# Altium schematic sheet input1-9.SchDoc
size 594 x 420 mm; Обозначение документа: QFP input1-9; Номер листа: 4; Общее количество листов: 9
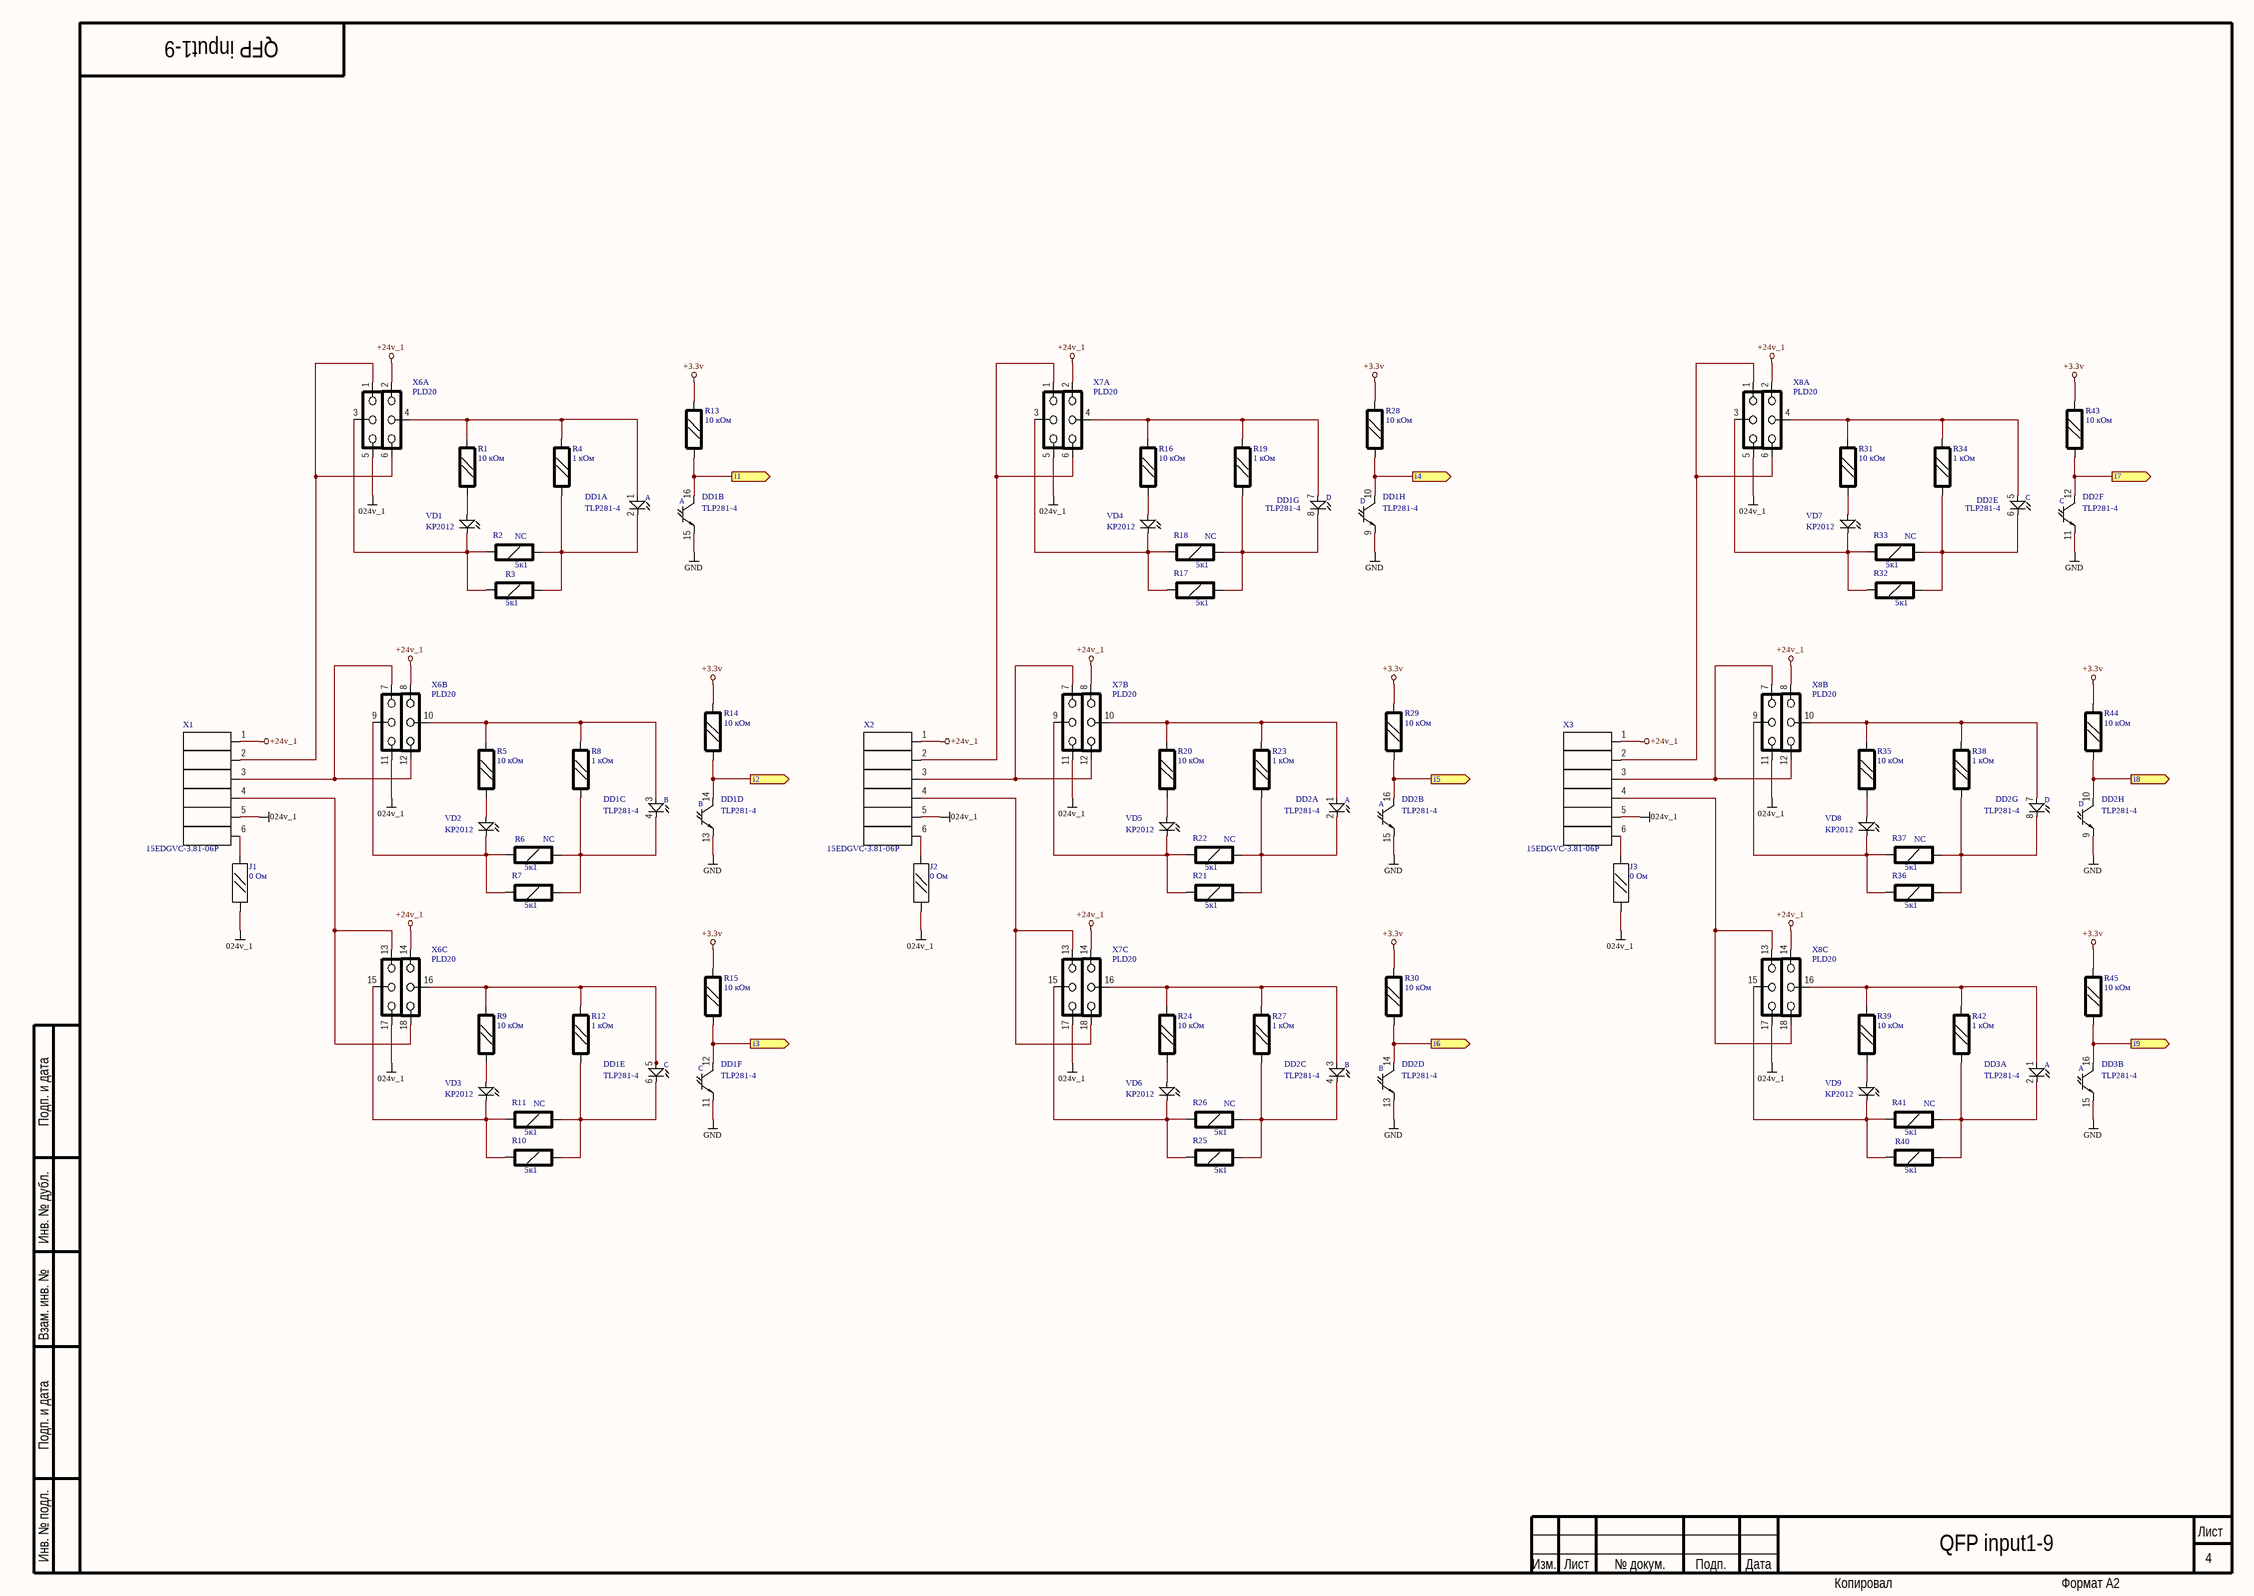
[diagram p0: input1-9.SchDoc]

## Parts
DD1  TLP281-4  [SO16]  (parts A,B,C,D,E,F,G,H of 8)
DD2  TLP281-4  [SO16]  (parts A,B,C,D,E,F,G,H of 8)
DD3  TLP281-4  [SO16]  (parts A,B of 8)
J1  0 Ом  [SMD0805RES]
J2  0 Ом  [SMD0805RES]
J3  0 Ом  [SMD0805RES]
R1  10 кОм  [SMD0805RES]
R2  5к1  SolderOpton: NC  [RES1206]
R3  5к1  [RES1206]
R4  1 кОм  [SMD0805RES]
R5  10 кОм  [SMD0805RES]
R6  5к1  SolderOpton: NC  [RES1206]
R7  5к1  [RES1206]
R8  1 кОм  [SMD0805RES]
R9  10 кОм  [SMD0805RES]
R10  5к1  [RES1206]
R11  5к1  SolderOpton: NC  [RES1206]
R12  1 кОм  [SMD0805RES]
R13  10 кОм  [SMD0805RES]
R14  10 кОм  [SMD0805RES]
R15  10 кОм  [SMD0805RES]
R16  10 кОм  [SMD0805RES]
R17  5к1  [RES1206]
R18  5к1  SolderOpton: NC  [RES1206]
R19  1 кОм  [SMD0805RES]
R20  10 кОм  [SMD0805RES]
R21  5к1  [RES1206]
R22  5к1  SolderOpton: NC  [RES1206]
R23  1 кОм  [SMD0805RES]
R24  10 кОм  [SMD0805RES]
R25  5к1  [RES1206]
R26  5к1  SolderOpton: NC  [RES1206]
R27  1 кОм  [SMD0805RES]
R28  10 кОм  [SMD0805RES]
R29  10 кОм  [SMD0805RES]
R30  10 кОм  [SMD0805RES]
R31  10 кОм  [SMD0805RES]
R32  5к1  [RES1206]
R33  5к1  SolderOpton: NC  [RES1206]
R34  1 кОм  [SMD0805RES]
R35  10 кОм  [SMD0805RES]
R36  5к1  [RES1206]
R37  5к1  SolderOpton: NC  [RES1206]
R38  1 кОм  [SMD0805RES]
R39  10 кОм  [SMD0805RES]
R40  5к1  [RES1206]
R41  5к1  SolderOpton: NC  [RES1206]
R42  1 кОм  [SMD0805RES]
R43  10 кОм  [SMD0805RES]
R44  10 кОм  [SMD0805RES]
R45  10 кОм  [SMD0805RES]
VD1  KP2012  [SMD0805DIO_C]
VD2  KP2012  [SMD0805DIO_C]
VD3  KP2012  [SMD0805DIO_C]
VD4  KP2012  [SMD0805DIO_C]
VD5  KP2012  [SMD0805DIO_C]
VD6  KP2012  [SMD0805DIO_C]
VD7  KP2012  [SMD0805DIO_C]
VD8  KP2012  [SMD0805DIO_C]
VD9  KP2012  [SMD0805DIO_C]
X1  15EDGVC-3.81-06P  [15EDGVC_081_6]
X2  15EDGVC-3.81-06P  [15EDGVC_081_6]
X3  15EDGVC-3.81-06P  [15EDGVC_081_6]
X6  PLD20  [pld2x10_1.27]  (parts A,B,C of 7)
X7  PLD20  [pld2x10_1.27]  (parts A,B,C of 7)
X8  PLD20  [pld2x10_1.27]  (parts A,B,C of 7)

## Ports
i1 (out), i2 (out), i3 (out), i4 (out), i5 (out), i6 (out), i7 (out), i8 (out), i9 (out)

## Nets
024v_1: J1.1 J2.2 J3.2 X1.5 X2.5 X3.5 X6.5 X6.11 X6.17 X7.5 X7.11 X7.17 X8.5 X8.11 X8.17
+3.3v: R13.2 R14.2 R15.2 R28.2 R29.2 R30.2 R43.2 R44.2 R45.2
+24v_1: X1.1 X2.1 X3.1 X6.2 X6.8 X6.14 X7.2 X7.8 X7.14 X8.2 X8.8 X8.14
GND: DD1.9(Emitter_D) DD1.11(Emitter_C) DD1.13(Emitter_B) DD1.15(Emitter_A) DD2.9(Emitter_D) DD2.11(Emitter_C) DD2.13(Emitter_B) DD2.15(Emitter_A) DD3.15(Emitter_A)
i1: DD1.16(Collector_A) R13.1 ; port i1
i2: DD1.14(Collector_B) R14.1 ; port i2
i3: DD1.12(Collector_C) R15.1 ; port i3
i4: DD1.10(Collector_D) R28.1 ; port i4
i5: DD2.16(Collector_A) R29.1 ; port i5
i6: DD2.14(Collector_B) R30.1 ; port i6
i7: DD2.12(Collector_C) R43.1 ; port i7
i8: DD2.10(Collector_D) R44.1 ; port i8
i9: DD3.16(Collector_A) R45.1 ; port i9
NetDD1_1: DD1.1(Anode_A) R1.1 R4.1 X6.4
NetDD1_2: DD1.2(Cathode_A) R2.2 R3.2 R4.2
NetDD1_3: DD1.3(Anode_B) R5.1 R8.1 X6.10
NetDD1_4: DD1.4(Cathode_B) R6.2 R7.2 R8.2
NetDD1_5: DD1.5(Anode_C) R9.1 R12.1 X6.16
NetDD1_6: DD1.6(Cathode) R10.2 R11.2 R12.2
NetDD1_7: DD1.7(Anode_D) R16.1 R19.1 X7.4
NetDD1_8: DD1.8(Cathode_D) R17.2 R18.2 R19.2
NetDD2_1: DD2.1(Anode_A) R20.1 R23.1 X7.10
NetDD2_2: DD2.2(Cathode_A) R21.2 R22.2 R23.2
NetDD2_3: DD2.3(Anode_B) R24.1 R27.1 X7.16
NetDD2_4: DD2.4(Cathode_B) R25.2 R26.2 R27.2
NetDD2_5: DD2.5(Anode_C) R31.1 R34.1 X8.4
NetDD2_6: DD2.6(Cathode) R32.2 R33.2 R34.2
NetDD2_7: DD2.7(Anode_D) R35.1 R38.1 X8.10
NetDD2_8: DD2.8(Cathode_D) R36.2 R37.2 R38.2
NetDD3_1: DD3.1(Anode_A) R39.1 R42.1 X8.16
NetDD3_2: DD3.2(Cathode_A) R40.2 R41.2 R42.2
NetJ1_2: J1.2 X1.6
NetJ2_1: J2.1 X2.6
NetJ3_1: J3.1 X3.6
NetR1_2: R1.2 VD1.2(Anode)
NetR2_1: R2.1 R3.1 VD1.1(Cathode) X6.3
NetR5_2: R5.2 VD2.2(Anode)
NetR6_1: R6.1 R7.1 VD2.1(Cathode) X6.9
NetR9_2: R9.2 VD3.2(Anode)
NetR10_1: R10.1 R11.1 VD3.1(Cathode) X6.15
NetR16_2: R16.2 VD4.2(Anode)
NetR17_1: R17.1 R18.1 VD4.1(Cathode) X7.3
NetR20_2: R20.2 VD5.2(Anode)
NetR21_1: R21.1 R22.1 VD5.1(Cathode) X7.9
NetR24_2: R24.2 VD6.2(Anode)
NetR25_1: R25.1 R26.1 VD6.1(Cathode) X7.15
NetR31_2: R31.2 VD7.2(Anode)
NetR32_1: R32.1 R33.1 VD7.1(Cathode) X8.3
NetR35_2: R35.2 VD8.2(Anode)
NetR36_1: R36.1 R37.1 VD8.1(Cathode) X8.9
NetR39_2: R39.2 VD9.2(Anode)
NetR40_1: R40.1 R41.1 VD9.1(Cathode) X8.15
NetX1_2: X1.2 X6.1 X6.6
NetX1_3: X1.3 X6.7 X6.12
NetX1_4: X1.4 X6.13 X6.18
NetX2_2: X2.2 X7.1 X7.6
NetX2_3: X2.3 X7.7 X7.12
NetX2_4: X2.4 X7.13 X7.18
NetX3_2: X3.2 X8.1 X8.6
NetX3_3: X3.3 X8.7 X8.12
NetX3_4: X3.4 X8.13 X8.18

## Notes on the sheet
- Подп. и дата
- Инв. № дубл.
- Взам. инв. №
- Инв. № подл.
- Изм.
- Лист
- № докум.
- Подп.
- Дата
- Копировал
- Формат А2
- (in symbol TLP281-4, part A) A
- (in symbol TLP281-4, part B) A
- (in symbol TLP281-4, part C) B
- (in symbol TLP281-4, part D) B
- (in symbol TLP281-4, part E) C
- (in symbol TLP281-4, part F) C
- (in symbol TLP281-4, part G) D
- (in symbol TLP281-4, part H) D

## Library data of the parts
DD1-DD3 = TLP281-4: 4х канальная транзисторная оптопара; Vendor: Tosba; Voltage: 80V; SolderOptoin: Norm; Value: TLP281-4; Price: 250
J1-J3 = JR0805: SMD 0805 перемычка; SolderOption: Norm; Price: 2; Vendor: *; Value: 0 Ом
R1 R4 R5 R8 R9 R12-R16 R19 R20 R23 R24 R27-R31 R34 R35 R38 R39 R42-R45 = R0805: Чип резистор 0805; Vendor: Generic; Tolerance: 5%; SolderOpton: Norm; Price: 2
  R1 R5 R9 R13-R16 R20 R24 R28-R31 R35 R39 R43-R45: Value: 10 кОм
  R4 R8 R12 R19 R23 R27 R34 R38 R42: Value: 1 кОм
R2 R6 R11 R18 R22 R26 R33 R37 R41 = R1206: Чип резистор 1206; Vendor: Generic; Tolerance: 5%; Price: 2; Value: 5к1
R3 R7 R10 R17 R21 R25 R32 R36 R40 = R1206: Чип резистор 1206; Vendor: Generic; Tolerance: 5%; SolderOpton: Norm; Price: 2; Value: 5к1
VD1-VD9 = KP2012_C: Чип светодиод 0805; Vendor: KB; Color: Green; SolderOpton: Norm; Price: 20; Value: KP2012
X1-X3 = 15EDGVC-3.81-06P: Вилка  6/3.81; Vendor: Degson; Current: 8А; Voltage: 2кВ; Price: 50; Value: 15EDGVC-3.81-06P
X6-X8 = PLD20: Вилка  PLD 20/1.27; Vendor: Confly; SolderOption: Norm; Price: 10; Value: PLD20